# Altium schematic sheet USB_to_Serial_Adapter.SchDoc
size 203 x 139 mm; SheetNumber: 8; SheetTotal: 8
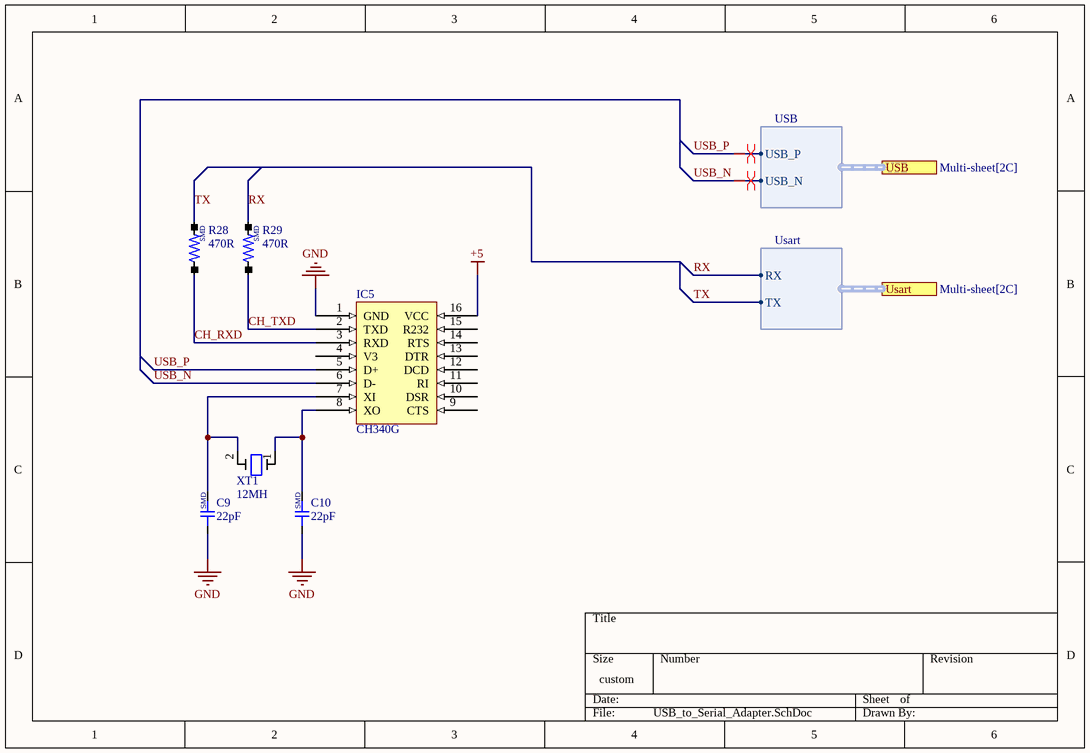
[diagram p0: USB_to_Serial_Adapter.SchDoc]

## Parts
C9  22pF  [CAP-0603]
C10  22pF  [CAP-0603]
IC5  CH340G  [SOP16]
R28  470R  [RES/0603]
R29  470R  [RES/0603]
XT1  12MH  [XTL16MH]

## Ports
Usart (harness Usart, see Multi-sheet[2C]), USB (harness USB, see Multi-sheet[2C])

## Harnesses
USB: USB_P, USB_N
Usart: RX, TX

## Nets
+5: IC5.16(VCC)
GND: C9.1 C10.1 IC5.1(GND)
CH_RXD: IC5.3(RXD) R28.1
CH_TXD: IC5.2(TXD) R29.1
RX: R29.2 ; port Usart.RX
TX: R28.2 ; port Usart.TX
USB_N: IC5.6(D-) ; port USB.USB_N
USB_P: IC5.5(D+) ; port USB.USB_P
NetC9_2: C9.2 IC5.7(XI) XT1.2
NetC10_2: C10.2 IC5.8(XO) XT1.1

Not connected (* = marked no-connect by the designer): IC5 4(V3) 9(CTS) 10(DSR) 11(RI) 12(DCD) 13(DTR) 14(RTS) 15(R232)

## Layout directives
differential pair: USB_N, USB_P

## Notes on the sheet
- (in symbol cap_smd) SMD
- (in symbol RES/SMD) SMD

## Library data of the parts
C9 C10 = cap_smd
R28 R29 = RES/SMD
XT1 = XTL16